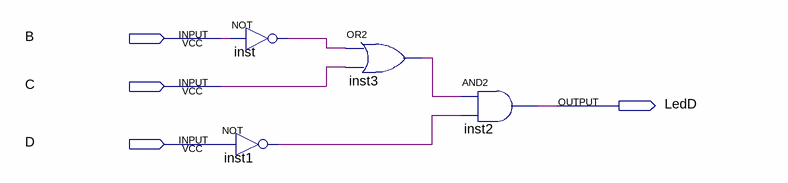
[diagram p0: schematic sheet]
// Quartus schematic LEDbcdD.bdf as structural Verilog: 4 symbols, 4 pins
module LEDbcdD (
  input  B,
  input  C,
  input  D,
  output LedD
);

  wire inst1_out, inst3_out, inst_out;

  not inst (inst_out, B);
  not inst1 (inst1_out, D);
  or inst3 (inst3_out, inst_out, C);
  and inst2 (LedD, inst3_out, inst1_out);
endmodule
